# Altium schematic sheet ADS1299.SchDoc
size A
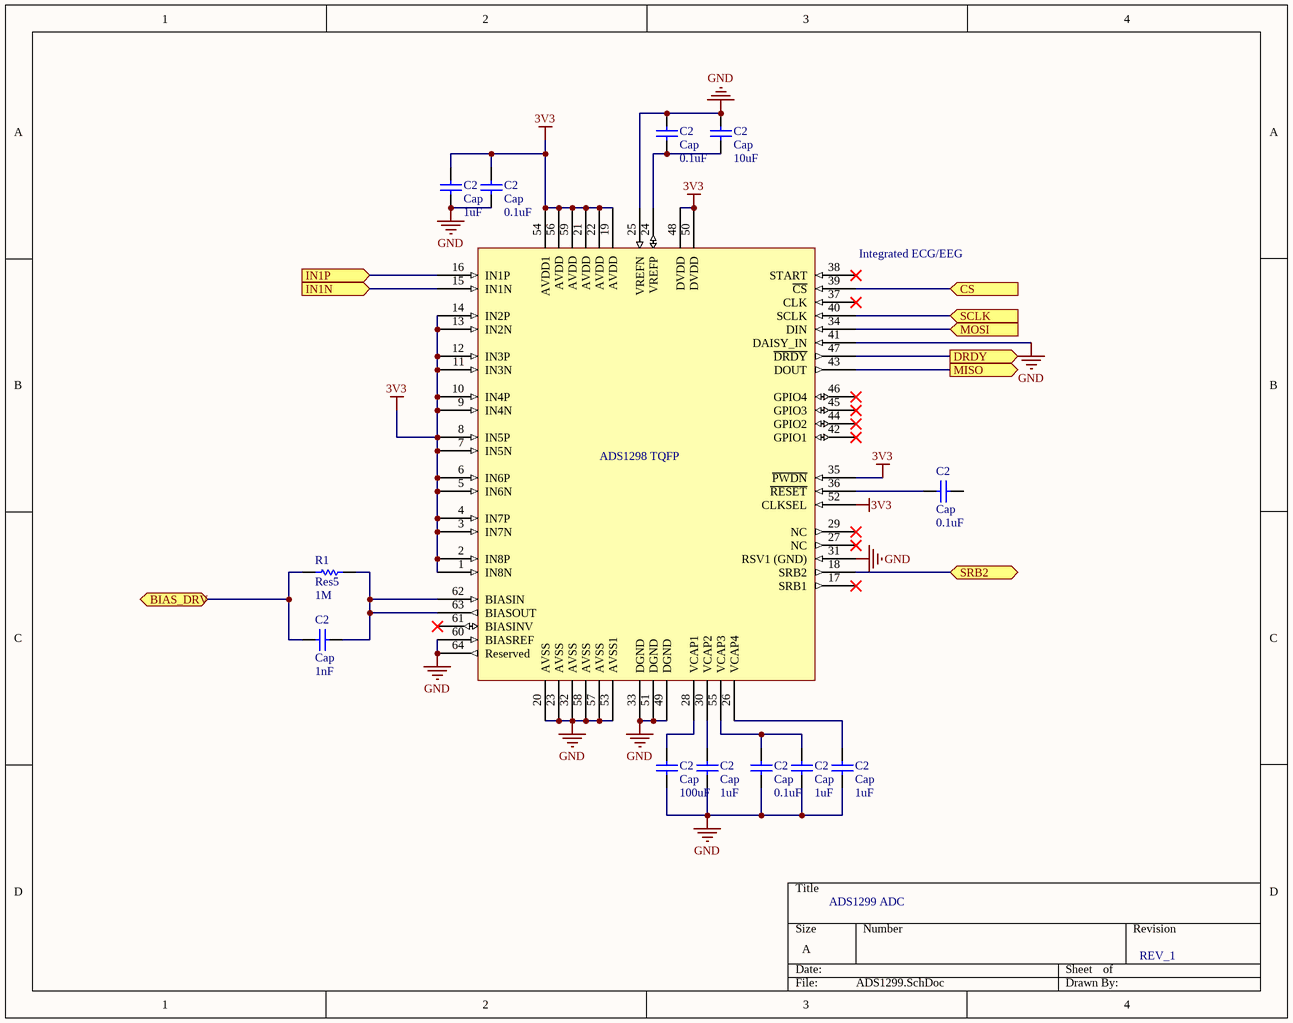
[diagram p0: ADS1299.SchDoc]

## Parts
(Parts that share a designator on the sheet are numbered #1, #2 ... from top to bottom, then left to right.)
?  Integrated ECG/EEG  [TQFP-PT64_N]
C2#1  Cap  value 0.1uF  [1608[0603]]
C2#2  Cap  value 10uF  [1608[0603]]
C2#3  Cap  value 1uF  [1608[0603]]
C2#4  Cap  value 0.1uF  [1608[0603]]
C2#5  Cap  value 0.1uF  [1608[0603]]
C2#6  Cap  value 1nF  [1608[0603]]
C2#7  Cap  value 100uF  [1608[0603]]
C2#8  Cap  value 1uF  [1608[0603]]
C2#9  Cap  value 0.1uF  [1608[0603]]
C2#10  Cap  value 1uF  [1608[0603]]
C2#11  Cap  value 1uF  [1608[0603]]
R1  Res5  value 1M  [1608[0603]]

## Ports
BIAS_DRV (bidir), CS (in), DRDY (out), IN1N (in), IN1P (in), MISO (out), MOSI (in), SCLK (in), SRB2 (bidir)

## Nets
3V3: ?.1(IN8N) ?.2(IN8P) ?.3(IN7N) ?.4(IN7P) ?.5(IN6N) ?.6(IN6P) ?.7(IN5N) ?.8(IN5P) ?.9(IN4N) ?.10(IN4P) ?.11(IN3N) ?.12(IN3P) ?.13(IN2N) ?.14(IN2P) ?.19(AVDD) ?.21(AVDD) ?.22(AVDD) ?.35(~{PWDN}) ?.48(DVDD) ?.50(DVDD) ?.52(CLKSEL) ?.54(AVDD1) ?.56(AVDD) ?.59(AVDD) C2#3.2 C2#4.2
GND: ?.20(AVSS) ?.23(AVSS) ?.25(VREFN) ?.31(RSV1_(GND)) ?.32(AVSS) ?.33(DGND) ?.41(DAISY_IN) ?.49(DGND) ?.51(DGND) ?.53(AVSS1) ?.57(AVSS) ?.58(AVSS) ?.60(BIASREF) ?.64(Reserved) C2#1.2 C2#2.2 C2#3.1 C2#4.1 C2#7.1 C2#8.1 C2#9.1 C2#10.1 C2#11.1
BIAS_DRV: C2#6.2 R1.2 ; port BIAS_DRV
CS: ?.39(~{CS}) ; port CS
DRDY: ?.47(~{DRDY}) ; port DRDY
IN1N: ?.15(IN1N) ; port IN1N
IN1P: ?.16(IN1P) ; port IN1P
MISO: ?.43(DOUT) ; port MISO
MOSI: ?.34(DIN) ; port MOSI
SCLK: ?.40(SCLK) ; port SCLK
SRB2: ?.18(SRB2) ; port SRB2
Net?_24: ?.24(VREFP) C2#1.1 C2#2.1
Net?_26: ?.26(VCAP4) C2#11.2
Net?_28: ?.28(VCAP1) C2#7.2
Net?_30: ?.30(VCAP2) C2#8.2
Net?_36: ?.36(~{RESET}) C2#5.1
Net?_55: ?.55(VCAP3) C2#9.2 C2#10.2
Net?_62: ?.62(BIASIN) ?.63(BIASOUT) C2#6.1 R1.1

Not connected (* = marked no-connect by the designer): ? 17(SRB1)* 27(NC)* 29(NC)* 37(CLK)* 38(START)* 42(GPIO1)* 44(GPIO2)* 45(GPIO3)* 46(GPIO4)* 61(BIASINV)*; C2#5 2

## Notes on the sheet
- ADS1299 ADC
- REV_1
- (in symbol ADS1298-TQFP) ADS1298 TQFP

## Library data of the parts
? = ADS1298-TQFP
C2#1-C2#11 = Cap: Capacitor; Published: 8-Jun-2000; LatestRevisionDate: 17-Jul-2002; LatestRevisionNote: Re-released for DXP Platform.; PackageReference: RAD-0.3; Publisher: Altium Limited; PackageDescription: Radial Cap, Thru-Hole; 2 Leads; 0.3 in Pin Spacing
R1 = Res1: Resistor; Published: 8-Jun-2000; LatestRevisionDate: 17-Jul-2002; LatestRevisionNote: Re-released for DXP Platform.; PackageReference: AXIAL-0.3; Publisher: Altium Limited; PackageDescription: Axial Device, Thru-Hole; 2 Leads; 0.3 in Pin Spacing